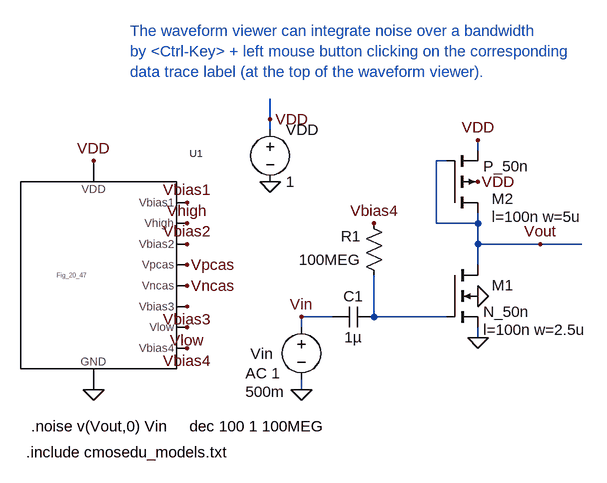
[diagram p0: schematic NOISE_Fig21_14.asc]
NOISE_Fig21_14.asc, the LTspice schematic file:
Version 4
SHEET 1 1784 680
WIRE 1072 -304 1072 -336
WIRE 1072 -288 1072 -304
WIRE 1392 -256 1392 -272
WIRE 1344 -240 1328 -240
WIRE 1328 -144 1328 -240
WIRE 1392 -144 1392 -160
WIRE 1392 -144 1328 -144
WIRE 1392 -112 1392 -144
WIRE 1488 -112 1392 -112
WIRE 1552 -112 1488 -112
WIRE 1392 -80 1392 -112
WIRE 1168 0 1120 0
WIRE 1232 0 1232 -64
WIRE 1344 0 1232 0
WIRE 1120 16 1120 0
WIRE 1392 32 1392 16
WIRE 1120 112 1120 96
FLAG 1072 -208 0
FLAG 1072 -304 VDD
FLAG 1392 -32 0
FLAG 1392 32 0
FLAG 1392 -272 VDD
FLAG 800 -240 VDD
FLAG 800 112 0
FLAG 944 -176 Vbias1
FLAG 944 -144 Vhigh
FLAG 944 -112 Vbias2
FLAG 944 -16 Vbias3
FLAG 944 -80 Vpcas
FLAG 944 -48 Vncas
FLAG 944 48 Vbias4
FLAG 944 16 Vlow
FLAG 1488 -112 Vout
FLAG 1120 112 0
FLAG 1120 0 Vin
FLAG 1392 -208 VDD
FLAG 1232 -144 Vbias4
SYMBOL voltage 1072 -304 R0
WINDOW 123 0 0 Left 2
WINDOW 39 0 0 Left 2
SYMATTR InstName VDD
SYMATTR Value 1
SYMBOL nmos4 1344 -80 R0
WINDOW 123 56 100 Left 2
WINDOW 0 69 31 Left 2
SYMATTR Value2 l=100n w=2.5u
SYMATTR InstName M1
SYMATTR Value N_50n
SYMBOL voltage 1120 0 R0
WINDOW 123 -86 87 Left 2
WINDOW 39 0 0 Left 2
WINDOW 3 -86 115 Left 2
WINDOW 0 -78 57 Left 2
SYMATTR Value2 AC 1
SYMATTR Value 500m
SYMATTR InstName Vin
SYMBOL Fig_20_47 800 -64 R0
SYMATTR InstName U1
SYMBOL pmos4 1344 -160 M180
WINDOW 0 69 22 Left 2
WINDOW 123 69 -6 Left 2
SYMATTR InstName M2
SYMATTR Value2 l=100n w=5u
SYMATTR Value P_50n
SYMBOL res 1248 -48 R180
WINDOW 0 36 76 Left 2
WINDOW 3 36 40 Left 2
SYMATTR InstName R1
SYMATTR Value 100MEG
SYMBOL cap 1232 -16 R90
WINDOW 0 0 32 VBottom 2
WINDOW 3 32 32 VTop 2
SYMATTR InstName C1
SYMATTR Value 1µ
TEXT 696 208 Left 2 !.include cmosedu_models.txt
TEXT 856 -440 Left 2 ;The waveform viewer can integrate noise over a bandwidth \nby <Ctrl-Key> + left mouse button clicking on the corresponding \ndata trace label (at the top of the waveform viewer).
TEXT 704 168 Left 2 !.noise v(Vout,0) Vin 	dec 100 1 100MEG

The netlist it stands for:
* NOISE_Fig21_14.asc
VDD VDD 0 1
M1 Vout N001 0 0 N_50n l=100n w=2.5u
Vin Vin 0 500m AC 1
XU1 Vbias1 Vhigh Vbias2 Vpcas Vncas Vbias3 Vlow Vbias4 VDD 0 Fig_20_47  ; pins Vbias1 Vhigh Vbias2 Vpcas Vncas Vbias3 Vlow Vbias4 VDD GND
M2 Vout Vout VDD VDD P_50n l=100n w=5u
R1 N001 Vbias4 100MEG
C1 N001 Vin 1µ
.model NMOS NMOS
.model PMOS PMOS
.lib standard.mos
.include cmosedu_models.txt
* The waveform viewer can integrate noise over a bandwidth
* by <Ctrl-Key> + left mouse button clicking on the corresponding
* data trace label (at the top of the waveform viewer).
.noise v(Vout,0) Vin 	dec 100 1 100MEG
.backanno
.end